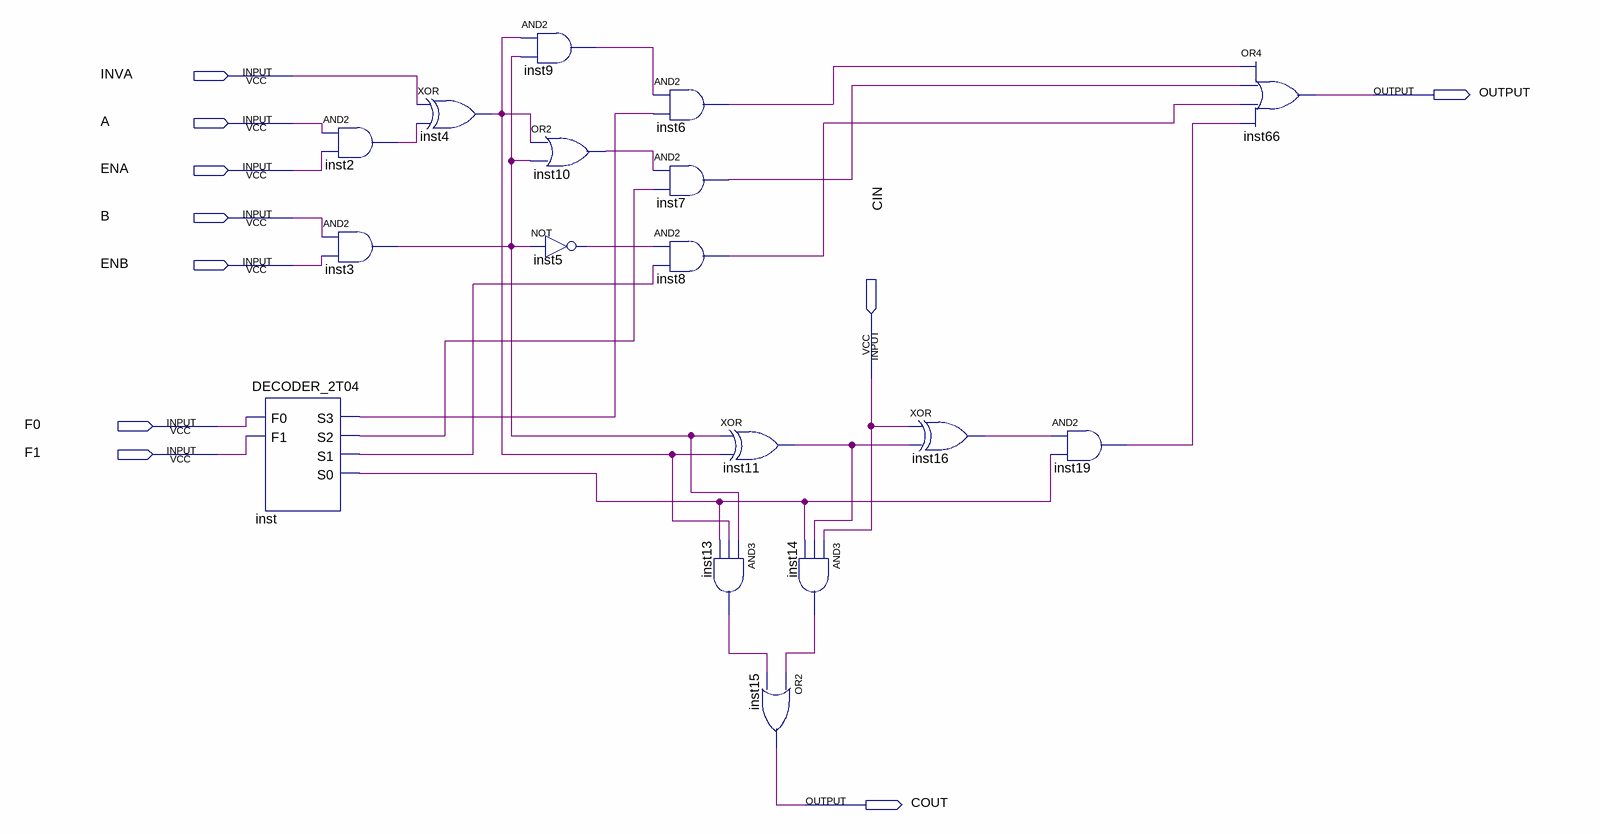
[diagram p0: schematic sheet]
// Quartus schematic ULA_1Bit.bdf as structural Verilog: 17 symbols, 10 pins
module ULA_1Bit (
  input  INVA,
  input  A,
  input  ENA,
  input  B,
  input  ENB,
  input  CIN,
  input  F0,
  input  F1,
  output OUTPUT,
  output COUT
);

  wire inst2_out, inst3_out, inst4_out, inst5_out, inst6_out, inst7_out, inst8_out, inst9_out, inst10_out,
       inst11_out, inst13_out, inst14_out, inst16_out, inst19_out, inst_s0, inst_s1, inst_s2, inst_s3;

  DECODER_2T04 inst (.F0(F0), .F1(F1), .S3(inst_s3), .S2(inst_s2), .S1(inst_s1), .S0(inst_s0));
  and inst2 (inst2_out, A, ENA);
  and inst3 (inst3_out, B, ENB);
  xor inst4 (inst4_out, INVA, inst2_out);
  and inst9 (inst9_out, inst4_out, inst3_out);
  or inst10 (inst10_out, inst4_out, inst3_out);
  not inst5 (inst5_out, inst3_out);
  and inst6 (inst6_out, inst9_out, inst_s3);
  and inst7 (inst7_out, inst10_out, inst_s2);
  and inst8 (inst8_out, inst5_out, inst_s1);
  xor inst11 (inst11_out, inst3_out, inst4_out);
  and inst13 (inst13_out, inst3_out, inst4_out, inst_s0);
  and inst14 (inst14_out, CIN, inst11_out, inst_s0);
  or inst15 (COUT, inst14_out, inst13_out);
  xor inst16 (inst16_out, CIN, inst11_out);
  and inst19 (inst19_out, inst16_out, inst_s0);
  or inst66 (OUTPUT, inst6_out, inst7_out, inst8_out, inst19_out);
endmodule
